# EAGLE design 5v_LP_Test_Mod (EAGLE 9.2.1)
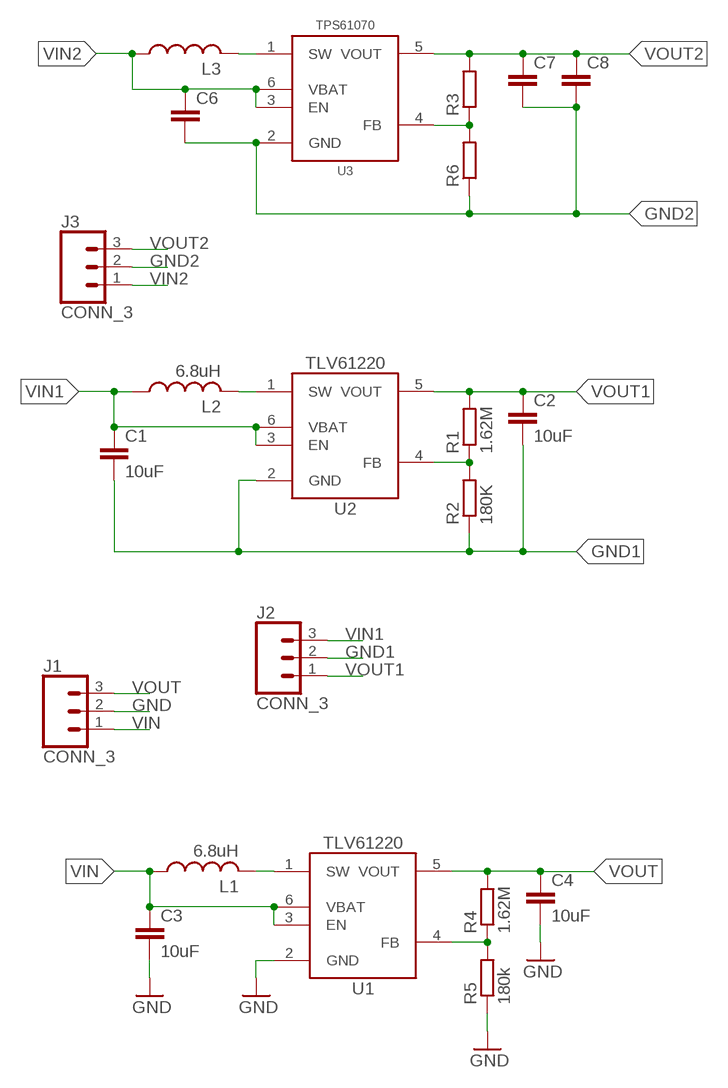
[diagram p0: schematic, sheet 1]

## Parts
C1  10uF  C-EU10UFC0805  [C0805]
C2  10uF  C-EU10UFC0805  [C0805]
C3  10uF  C-EU10UFC0805  [C0805]
C4  10uF  C-EU10UFC0805  [C0805]
C6  C-EUC0805  [C0805]
C7  C-EUC0603  [C0603]
C8  C-EUC0603  [C0603]
J1  CONN_3  [1X03]
J2  CONN_3  [1X03]
J3  CONN_3  [1X03]
L1  6.8uH  INDUCTOR1008  [1008]
L2  6.8uH  INDUCTOR1008  [1008]
L3  INDUCTORTPC_3.8X3.8  [WE-TPC(3.8X3.8)]
R1  1.62M  R-EU_R0603  [R0603]
R2  180K  R-EU_R0603  [R0603]
R3  R-EU_R0603  [R0603]
R4  1.62M  R-EU_1.62MR0603  [R0603]
R5  180k  R-EU_180KR0603  [R0603]
R6  R-EU_R0603  [R0603]
U1  TLV61220DBV  [DBV_R-PDSO-G6]
U2  TLV61220DBV  [DBV_R-PDSO-G6]
U3  TPS61070DDC  [DDC_R-PDSO-G6]

## Nets
GND: C3.2 C4.2 J1.2 R5.1 U1.2(GND)
GND1: C1.2 C2.2 J2.2 R2.1 U2.2(GND)
GND2: C6.2 C7.2 C8.2 J3.2 R6.1 U3.2(GND)
N$1: R1.1 R2.2 U2.4(FB)
N$2: L3.2 U3.1(SW)
N$5: L2.2 U2.1(SW)
N$6: R3.1 R6.2 U3.4(FB)
N$7: R4.1 R5.2 U1.4(FB)
N$9: L1.2 U1.1(SW)
VIN: C3.1 J1.1 L1.1 U1.3(EN) U1.6(VBAT)
VIN1: C1.1 J2.3 L2.1 U2.3(EN) U2.6(VBAT)
VIN2: C6.1 J3.1 L3.1 U3.3(EN) U3.6(VBAT)
VOUT: C4.1 J1.3 R4.2 U1.5(VOUT)
VOUT1: C2.1 J2.1 R1.2 U2.5(VOUT)
VOUT2: C7.1 C8.1 J3.3 R3.2 U3.5(VOUT)

## Library data of the parts
C1-C4 = bschulz_passives:C-EU: CAPACITOR, European symbol; DIGIKEY: 490-6473-6-ND; MF: Murata; MPN: GRM21BR61C106KE15K
C6-C8 = bschulz_passives:C-EU: CAPACITOR, European symbol
J1-J3 = bschulz:CONN_3: Genaric 3 terminal header Digikey 2.54_SCREW <https://www.digikey.com/product-detail/en/on-shore-technology-inc/OSTVN03A150/ED10562-ND/1588863> 3.5_SCREW <https://www.digikey.com/product-detail/en/on-shore-technology-inc/OSTTE030161/ED2636-ND/614585>
L1 = bschulz:INDUCTOR: Genaric inductor; DIGIKEY: 732-4849-1-ND; MF: Wurth; MPN: 74438323068
L2 L3 = bschulz:INDUCTOR: Genaric inductor
R1-R3 R6 = bschulz_passives:R-EU_: RESISTOR, European symbol Digikey Parts: Yageo, 0402 <https://www.digikey.com/products/en/resistors/chip-resistor-surface-mount/52?k=&pkeyword=&sf=0&FV=ffec1104%2Cfffc000d%2C1c0002%2C440067%2C1f140000%2Cffe00034%2C400004&quantity=&ColumnSort=0&page=1&stock=1&pageSize=25> Yageo, 0603 <https://www.digikey.com/products/en/resistors/chip-resistor-surface-mount/52?k=&pkeyword=&s=4356&s=47360&sf=0&FV=fffc000d%2C1c0002%2C142c040c%2C1f140000%2Cffe00034&quantity=10&ColumnSort=1000011&page=1&stock=1&pageSize=25> Panasonic, 0603 <https://www.digikey.com/products/en/resistors/chip-resistor-surface-mount/52?k=&pkeyword=&pv252=68&sf=0&FV=ffec373d%2C1c0002%2C142c040c%2C1f140000%2Cffe00034%2C80002%2Cc0001&quantity=&ColumnSort=0&page=1&stock=1&pageSize=25> Panasonic, precision, 0603 <https://www.digikey.com/products/en/resistors/chip-resistor-surface-mount/52?FV=ffec4907%2Cfffc000a%2Cc0172%2C142c040c%2C1f140000%2Cffe00034%2C1c0002&quantity=100&ColumnSort=2085&page=1&stock=1&pageSize=25> Panasonic, 0805 <https://www.digikey.com/products/en/resistors/chip-resistor-surface-mount/52?k=&pkeyword=&pv3=1&sf=0&FV=ffec373d%2C1c0002%2C1f140000%2Cffe00034%2C142c040d&quantity=&ColumnSort=0&page=1&stock=1&pageSize=25> Rohm, current sense <https://www.digikey.com/products/en/resistors/chip-resistor-surface-mount/52?k=&pkeyword=&pv3=1&sf=0&FV=ffecb688%2C1f140000%2Cffe00034%2C1c0002&quantity=&ColumnSort=0&page=1&stock=1&pageSize=25> Vishay, pulse proof automotive <https://www.digikey.com/products/en/resistors/chip-resistor-surface-mount/52?k=&pkeyword=&pv7=2&sf=0&FV=ffec5d6b%2Cffe00034%2C1f140000&quantity=&ColumnSort=0&page=1&stock=1&pageSize=25>; MF: Yageo
R4 = bschulz_passives:R-EU_: RESISTOR, European symbol Digikey Parts: Yageo, 0402 <https://www.digikey.com/products/en/resistors/chip-resistor-surface-mount/52?k=&pkeyword=&sf=0&FV=ffec1104%2Cfffc000d%2C1c0002%2C440067%2C1f140000%2Cffe00034%2C400004&quantity=&ColumnSort=0&page=1&stock=1&pageSize=25> Yageo, 0603 <https://www.digikey.com/products/en/resistors/chip-resistor-surface-mount/52?k=&pkeyword=&s=4356&s=47360&sf=0&FV=fffc000d%2C1c0002%2C142c040c%2C1f140000%2Cffe00034&quantity=10&ColumnSort=1000011&page=1&stock=1&pageSize=25> Panasonic, 0603 <https://www.digikey.com/products/en/resistors/chip-resistor-surface-mount/52?k=&pkeyword=&pv252=68&sf=0&FV=ffec373d%2C1c0002%2C142c040c%2C1f140000%2Cffe00034%2C80002%2Cc0001&quantity=&ColumnSort=0&page=1&stock=1&pageSize=25> Panasonic, precision, 0603 <https://www.digikey.com/products/en/resistors/chip-resistor-surface-mount/52?FV=ffec4907%2Cfffc000a%2Cc0172%2C142c040c%2C1f140000%2Cffe00034%2C1c0002&quantity=100&ColumnSort=2085&page=1&stock=1&pageSize=25> Panasonic, 0805 <https://www.digikey.com/products/en/resistors/chip-resistor-surface-mount/52?k=&pkeyword=&pv3=1&sf=0&FV=ffec373d%2C1c0002%2C1f140000%2Cffe00034%2C142c040d&quantity=&ColumnSort=0&page=1&stock=1&pageSize=25> Rohm, current sense <https://www.digikey.com/products/en/resistors/chip-resistor-surface-mount/52?k=&pkeyword=&pv3=1&sf=0&FV=ffecb688%2C1f140000%2Cffe00034%2C1c0002&quantity=&ColumnSort=0&page=1&stock=1&pageSize=25> Vishay, pulse proof automotive <https://www.digikey.com/products/en/resistors/chip-resistor-surface-mount/52?k=&pkeyword=&pv7=2&sf=0&FV=ffec5d6b%2Cffe00034%2C1f140000&quantity=&ColumnSort=0&page=1&stock=1&pageSize=25>; DIGIKEY: RMCF0603FT1M62CT-ND; MF: Stackpole; MPN: RMCF0603FT1M62; VALUE_PART: 1.62M
R5 = bschulz_passives:R-EU_: RESISTOR, European symbol Digikey Parts: Yageo, 0402 <https://www.digikey.com/products/en/resistors/chip-resistor-surface-mount/52?k=&pkeyword=&sf=0&FV=ffec1104%2Cfffc000d%2C1c0002%2C440067%2C1f140000%2Cffe00034%2C400004&quantity=&ColumnSort=0&page=1&stock=1&pageSize=25> Yageo, 0603 <https://www.digikey.com/products/en/resistors/chip-resistor-surface-mount/52?k=&pkeyword=&s=4356&s=47360&sf=0&FV=fffc000d%2C1c0002%2C142c040c%2C1f140000%2Cffe00034&quantity=10&ColumnSort=1000011&page=1&stock=1&pageSize=25> Panasonic, 0603 <https://www.digikey.com/products/en/resistors/chip-resistor-surface-mount/52?k=&pkeyword=&pv252=68&sf=0&FV=ffec373d%2C1c0002%2C142c040c%2C1f140000%2Cffe00034%2C80002%2Cc0001&quantity=&ColumnSort=0&page=1&stock=1&pageSize=25> Panasonic, precision, 0603 <https://www.digikey.com/products/en/resistors/chip-resistor-surface-mount/52?FV=ffec4907%2Cfffc000a%2Cc0172%2C142c040c%2C1f140000%2Cffe00034%2C1c0002&quantity=100&ColumnSort=2085&page=1&stock=1&pageSize=25> Panasonic, 0805 <https://www.digikey.com/products/en/resistors/chip-resistor-surface-mount/52?k=&pkeyword=&pv3=1&sf=0&FV=ffec373d%2C1c0002%2C1f140000%2Cffe00034%2C142c040d&quantity=&ColumnSort=0&page=1&stock=1&pageSize=25> Rohm, current sense <https://www.digikey.com/products/en/resistors/chip-resistor-surface-mount/52?k=&pkeyword=&pv3=1&sf=0&FV=ffecb688%2C1f140000%2Cffe00034%2C1c0002&quantity=&ColumnSort=0&page=1&stock=1&pageSize=25> Vishay, pulse proof automotive <https://www.digikey.com/products/en/resistors/chip-resistor-surface-mount/52?k=&pkeyword=&pv7=2&sf=0&FV=ffec5d6b%2Cffe00034%2C1f140000&quantity=&ColumnSort=0&page=1&stock=1&pageSize=25>; DIGIKEY: P180KHCT-ND; MF: Panasonic; MPN: ERJ-3EKF1803V; VALUE_PART: 180k
U1 U2 = bschulz:TLV61220: TLV61220 - Low-Input Voltage Step-Up Converter (Boost) Characteristics: Vin: 0.7V ~ 5.5V Vout: 1.8V ~ 5.5V Output Current (Max): 400 mA IQ: 5μA Operating Temperature: -40°C to 85°C Digikey: 296-30547-1-ND <https://www.digikey.com/product-detail/en/texas-instruments/TLV61220DBVR/296-30547-1-ND/3458120>; DIGIKEY: 296-30547-1-ND; MF: TI; MPN: TLV61220DBVR
U3 = bschulz:TPS6107*: TPS6217x - Efficient Synchronous Boost Converter Characteristics: Vin: 0.9V ~ 5.5V Vout: < 5.5V Output Current: 600 mA IQ: 19 μA Operating Temperature: -40°C to 85°C Digikey: TPS61070 (Power Save, Adj) <https://www.digikey.com/product-detail/en/texas-instruments/TPS61070DDCR/296-17151-1-ND/665930>; DIGIKEY: 296-17151-1-ND; DISP: TPS61070; MF: TI; MPN: TPS61070DDCR

## Board
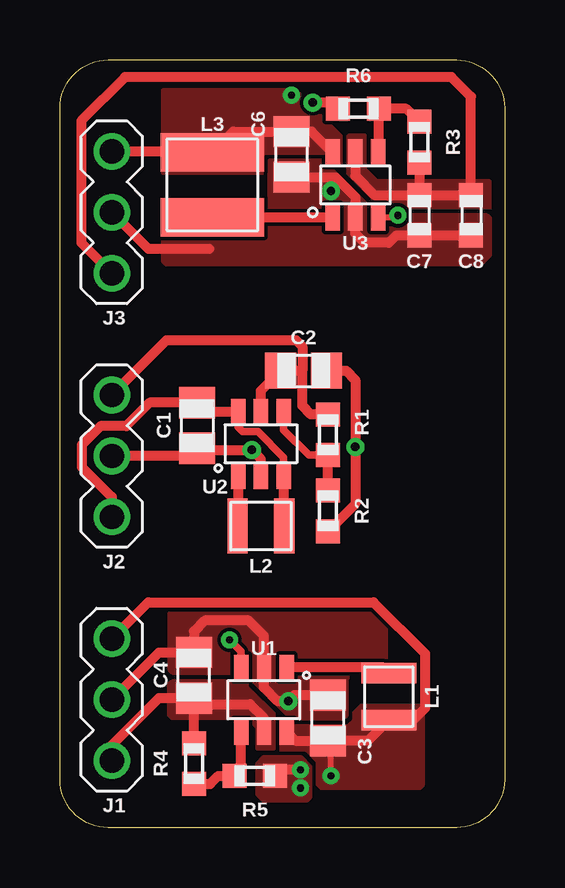
[diagram p1: board, top side]
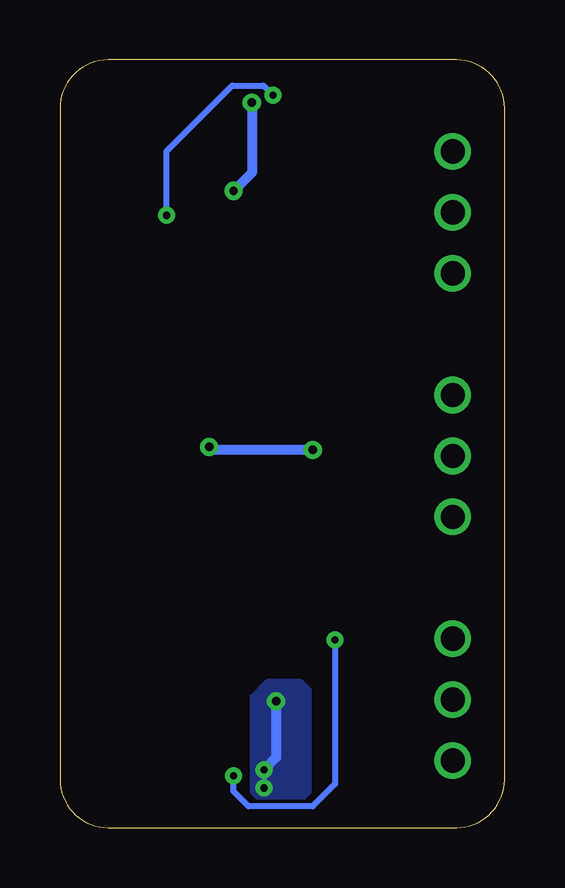
[diagram p2: board, bottom side, seen from below]

Size 18.54 x 32 mm. Coordinates in mm from the lower left corner, seen from the top.
Outline: 16.54,0 2,0 arc-90 0,2 0,30 arc-90 2,32 16.54,32 arc-90 18.54,30 18.54,2 arc-90 16.54,0
Copper layers (1*16): Top 0.0178mm / dielectric 59mil / Bottom 0.0178mm
Design rules "SSC-EAGLE-2Lyr_v1.0.0.3 *": minimum track width 5mil, minimum drill 8mil, track to track 6mil, track to pad 6mil, pad to pad 6mil, via to via 6mil, smd to smd 6mil, copper to edge 20mil, drill to drill 16mil, minimum pad ring 8mil, minimum via ring 8mil, stop-mask expansion 3mil, vias tented up to drill 0mil, thermal gap 10mil

### Footprints (pad centres in the part's own frame; a part is rotated, then mirrored left to right if it is on the bottom)
C0805 = smd 1.3 x 1.5: 1 -0.95,0; 2 0.95,0
C0603 = smd 1 x 1: 1 -0.85,0; 2 0.85,0
1X03 = drill 1.016: 1 -2.54,0; 2 0,0; 3 2.54,0
1008 = smd 0.85 x 2.3: 1 -0.975,0; 2 0.975,0
WE-TPC(3.8X3.8) = smd 1.6 x 4.3: 1 -1.35,0; 2 1.35,0
R0603 = smd 1 x 1: 1 -0.85,0; 2 0.85,0
DBV_R-PDSO-G6 = smd 0.6 x 1.05: 1 -0.95,-1.35; 2 0,-1.35; 3 0.95,-1.35; 4 0.95,1.35; 5 0,1.35; 6 -0.95,1.35
DDC_R-PDSO-G6 = smd 0.6 x 1.1: 1 -0.95,-1.35; 2 0,-1.35; 3 0.95,-1.35; 4 0.95,1.35; 5 0,1.35; 6 -0.95,1.35

### Placement (x,y rotation side)
C1  5.71,16.76 270 top
C2  10.16,19.05 0 top
C3  11.18,4.57 90 top
C4  5.59,6.35 90 top
C6  9.65,28.07 270 top
C7  14.99,25.53 270 top
C8  17.14,25.53 270 top
J1  2.16,5.33 270 top
J2  2.16,15.49 270 top
J3  2.16,25.65 270 top
L1  13.72,5.46 90 top
L2  8.38,12.57 180 top
L3  6.35,26.8 270 top
R1  11.18,16.38 90 top
R2  11.18,13.21 90 top
R3  14.99,28.57 270 top
R4  5.59,2.67 90 top
R5  8.13,2.16 180 top
R6  12.45,29.97 0 top
U1  8.51,5.33 180 top
U2  8.38,16 0 top
U3  12.32,26.8 0 top

### Tracks (layer width: path | path; a pad name or v marks a point on that pad's centre or on a via)
GND  (via drill 0.3, 0.35)
  Top 0.406: C3.2 9.78,5.52 v9.53,5.27 9.08,5.27 8.51,5.84 U1.2 8.51,8 7.87,8.64 6.04,8.64 5.59,8.19 C4.2 4.12,7.3 J1.2 | v10.03,2.41 9.23,2.41 R5.1
  Bottom 0.203: v10.03,2.41 v10.03,1.65
  Bottom 0.406: v9.53,5.27 9.53,2.92 v10.03,2.41
  pour Top (no thermals): 4.57,8.89 4.57,6.6 4.7,6.48 7.75,6.48 9.65,4.57 11.81,4.57 11.94,4.7 11.94,6.22 12.57,6.86 13.59,6.86 13.59,8.89
  pour Top (no thermals): 8.26,2.67 8.51,2.92 10.03,2.92 10.41,2.54 10.41,1.27 10.29,1.14 8.51,1.14 8.26,1.4
  pour Bottom: 10.54,1.52 10.29,1.27 8.38,1.27 8.13,1.52 8.13,5.71 8.51,6.1 9.91,6.1 10.54,5.46
GND1  (via drill 0.35)
  Top 0.406: U2.2 8.38,15.37 v8,15.75 5.78,15.75 C1.2 5.39,15.49 J2.2 | C2.2 11.94,19.05 12.32,18.67 v12.32,15.88 12.32,13.5 R2.1
  Bottom 0.406: v8,15.75 12.26,15.75 v12.32,15.88
GND2  (via drill 0.35)
  Top 0.406: C8.2 C7.2 14.01,24.68 13.72,24.38 12.7,24.38 12.32,24.77 U3.2 12.32,26.29 11.49,27.12 C6.2 | R6.1 11.34,30.23 v10.54,30.23 | J3.2 3.68,24.13 6.22,24.13
  Bottom 0.406: v10.54,30.23 10.54,27.3 v11.3,26.54
  pour Top (no thermals): 8.76,27.81 10.92,27.81 12.83,25.91 12.83,25.53 17.78,25.53 17.91,25.4 17.91,23.88 17.53,23.5 4.45,23.5 4.32,23.62 4.32,24.64 8.38,24.64 8.76,25.02
N$1
  Top 0.305: R1.1 10.38,15.53 9.33,16.58 U2.4
  Top 0.406: R2.2 R1.1
N$2
  Top 0.406: L3.2 U3.1
N$5
  Top 0.406: U2.1 7.43,12.6 L2.2
N$6
  Top 0.406: R3.1 14.44,29.97 R6.2 13.3,28.17 U3.4
N$7
  Top 0.406: R4.1 6.26,1.82 6.6,2.16 R5.2 7.56,2.44 U1.4
N$9
  Top 0.406: L1.2 13.47,6.68 U1.1
VIN  (via drill 0.3)
  Top 0.254: v11.3,2.16 11.3,3.5 C3.1
  Top 0.305: U1.3 7.56,7.34 v7.07,7.83
  Top 0.406: U1.6 9.82,3.62 C3.1 12.85,3.62 L1.1 14.73,4.49 15.22,4.98 15.22,7.26 13.08,9.4 3.68,9.4 J1.1
  Bottom 0.254: v7.07,7.83 7.07,1.82 8,0.89 10.67,0.89 11.3,1.52 v11.3,2.16
  pour Top (rank 3, no thermals): 9.14,4.57 9.78,4.57 10.03,4.32 11.81,4.32 12.57,5.08 15.11,5.08 15.11,1.78 14.99,1.65 10.92,1.65 10.67,1.91 10.67,2.29 10.03,2.92 9.27,2.92 9.14,3.05
VIN1
  Top 0.305: U2.6 7.43,16.7 7.62,16.51 8.26,16.51 9.33,15.44 U2.3
  Top 0.406: U2.6 6.08,17.35 C1.1 3.74,17.71 2.77,16.74 1.7,16.74 0.91,15.96 0.91,15.03 2.16,13.79 J2.3 | U2.3 9.33,12.6 L2.1
VIN2  (via drill 0.3)
  Top 0.254: U3.3 14.02,25.45 v14.1,25.53
  Top 0.406: U3.6 10.5,29.02 C6.1 7.22,29.02 6.4,28.19 | L3.1 6.4,28.19 | J3.1 6.4,28.19
  Bottom 0.254: v14.1,25.53 14.1,28.19 11.36,30.93 10.05,30.93 v9.65,30.53
  pour Top (rank 2, no thermals): 8.51,27.3 4.32,27.3 4.32,30.73 9.78,30.73 11.68,28.83 11.68,27.43 8.64,27.43
VOUT
  Top 0.406: U1.5 8.51,4.57 7.93,5.15 5.84,5.15 C4.1 | R4.2 C4.1 | J1.3 2.16,3.43 4.13,5.4 C4.1
  pour Top (rank 2, no thermals): 4.57,5.97 4.7,6.1 7.75,6.1 8.89,4.95 8.89,3.3 8.26,3.3 8.26,4.19 7.87,4.57 4.7,4.57 4.57,4.7
VOUT1
  Top 0.406: U2.5 8.38,18.22 C2.1 10.1,19.05 | R1.2 10.45,17.23 10.1,17.58 10.1,19.05 | 10.1,19.05 10.1,20.07 9.85,20.32 4.45,20.32 J2.1
VOUT2
  Top 0.406: U3.5 12.32,27.18 13.12,26.38 C7.1 | C7.1 C8.1 17.14,30.48 16.33,31.29 2.72,31.29 0.89,29.46 0.89,24.38 J3.3 | R3.2 C7.1
  pour Top (rank 3, no thermals): 11.94,28.7 11.94,27.18 12.95,26.16 13.97,26.16 14.48,25.65 17.78,25.65 17.91,25.78 17.91,26.92 13.21,26.92 12.7,27.43 12.7,28.83 12.06,28.83

### Text on the board
tDocu: Vin | GND | Vout | Alternative | Vin | GND | Vout | Control | Vin | GND | Vout | Modified